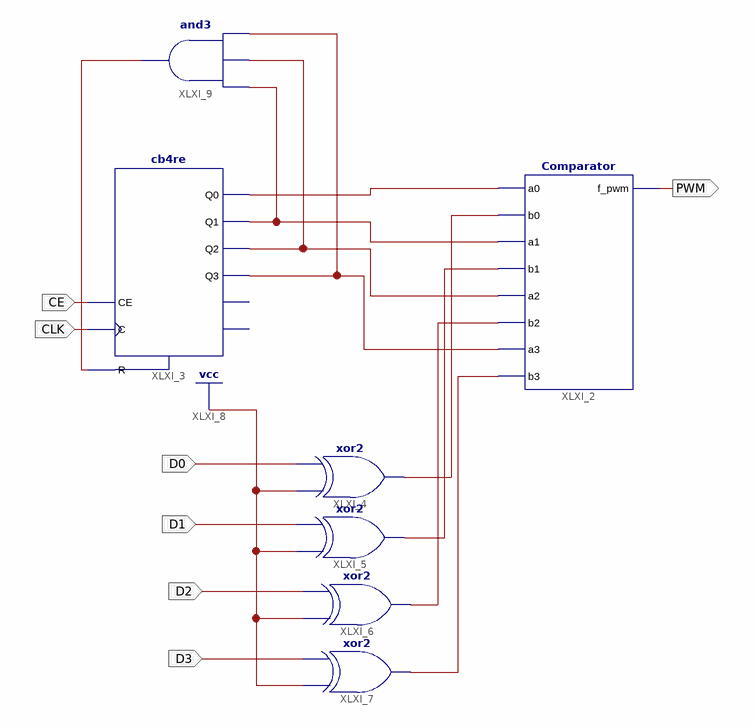
[diagram p0: schematic sheet 1]
// Xilinx ISE schematic PWM_VNB.sch (spartan3e) as structural Verilog: 7 symbols, 7 ports
module PWM_VNB (
  input  D0,
  input  D1,
  input  D2,
  input  D3,
  input  CLK,
  input  CE,
  output PWM
);

  wire XLXN_1, XLXN_2, XLXN_3, XLXN_4, XLXN_5, XLXN_6, XLXN_7, XLXN_8, XLXN_20;

  Comparator XLXI_2 (
    .a0(XLXN_1), .b0(XLXN_5), .a1(XLXN_2), .b1(XLXN_6), .a2(XLXN_3), .b2(XLXN_7), .a3(XLXN_4), .b3(XLXN_8),
    .f_pwm(PWM));
  cb4re XLXI_3 (.C(CLK), .CE(CE), .R(XLXN_20), .Q0(XLXN_1), .Q1(XLXN_2), .Q2(XLXN_3), .Q3(XLXN_4));  // open: CEO, TC
  xor XLXI_4 (XLXN_5, 1'b1, D0);
  xor XLXI_5 (XLXN_6, 1'b1, D1);
  xor XLXI_6 (XLXN_7, 1'b1, D2);
  xor XLXI_7 (XLXN_8, 1'b1, D3);
  and XLXI_9 (XLXN_20, XLXN_4, XLXN_3, XLXN_2);
endmodule
